# Altium schematic sheet Sheet1.SchDoc
size A4; SheetNumber: 1; SheetTotal: 1
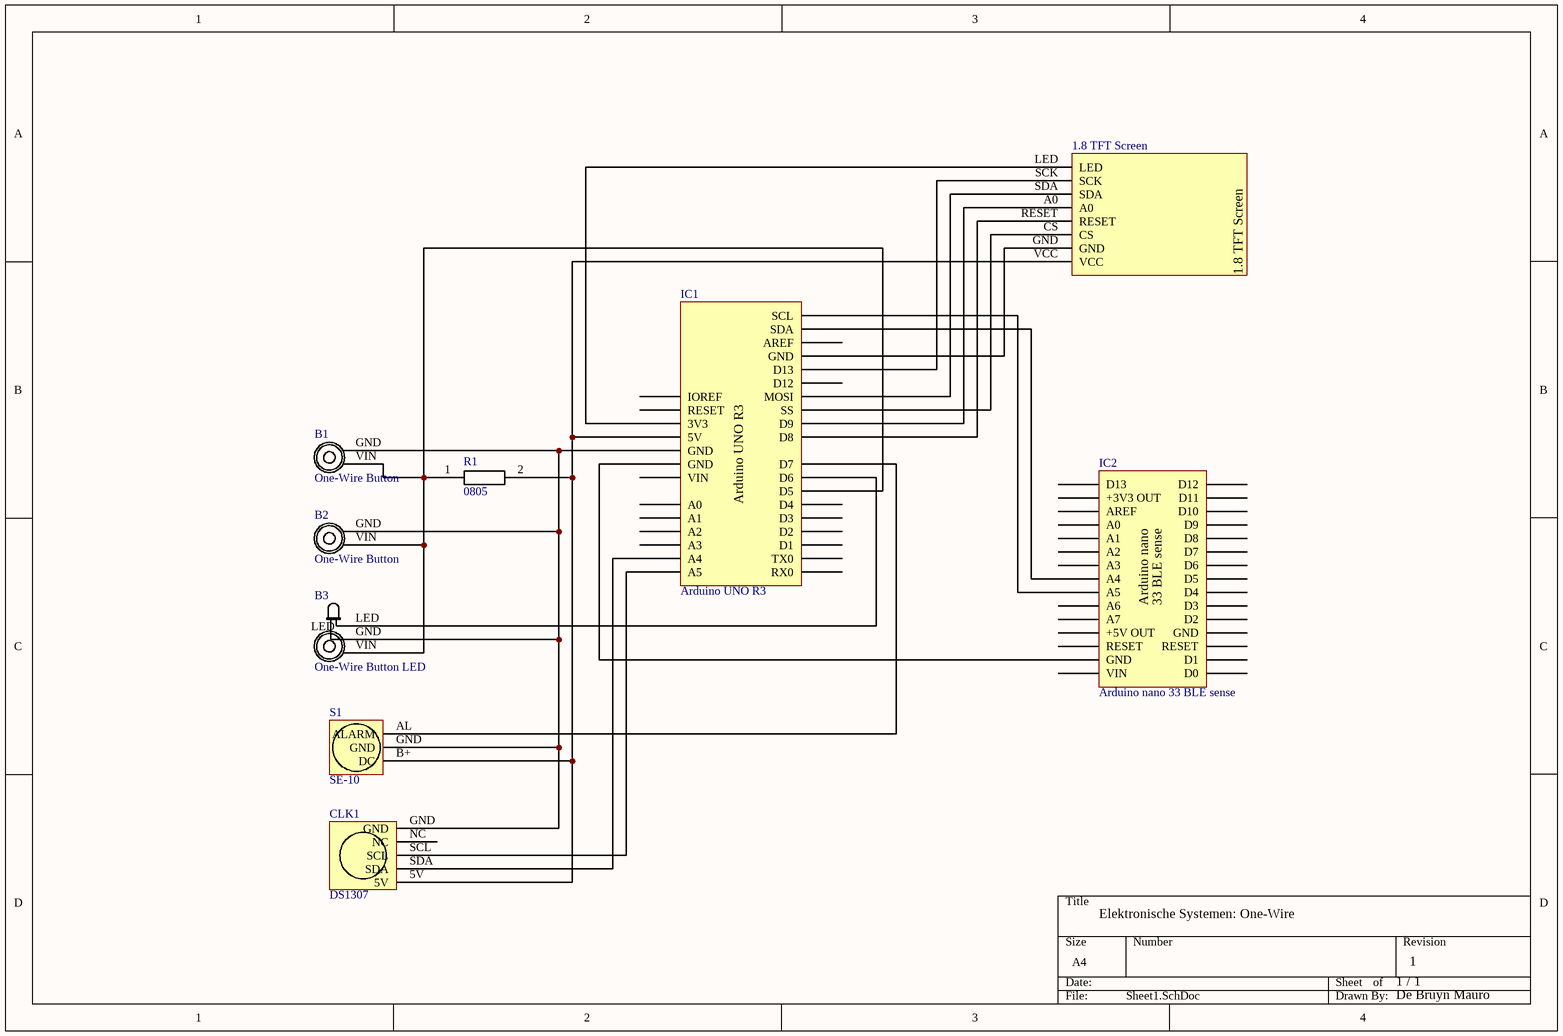
[diagram p0: Sheet1.SchDoc]

## Parts
1.8_TFT_Screen  (no value)
B1  One-Wire Button
B2  One-Wire Button
B3  One-Wire Button LED
CLK1  DS1307
IC1  Arduino UNO R3
IC2  Arduino nano 33 BLE sense
R1  0805
S1  SE-10

## Nets
Net1.8_TFT_Screen_A0: 1.8_TFT_Screen.A0 IC1.D9
Net1.8_TFT_Screen_CS: 1.8_TFT_Screen.CS IC1.D10(SS)
Net1.8_TFT_Screen_GND: 1.8_TFT_Screen.GND IC1.GROUND(GND)
Net1.8_TFT_Screen_LED: 1.8_TFT_Screen.LED IC1.3V3
Net1.8_TFT_Screen_RESET: 1.8_TFT_Screen.RESET IC1.D8
Net1.8_TFT_Screen_SCK: 1.8_TFT_Screen.SCK IC1.SCK(D13)
Net1.8_TFT_Screen_SDA: 1.8_TFT_Screen.SDA IC1.D11(MOSI)
Net1.8_TFT_Screen_VCC: 1.8_TFT_Screen.VCC CLK1.5V IC1.5V(VIN) R1.2 S1.B+(DC)
NetB1_GND: B1.GND B2.GND B3.GND CLK1.GND IC1.GND S1.GND
NetB1_VIN: B1.VIN B2.VIN B3.VIN IC1.D5 R1.1
NetB3_LED: B3.LED IC1.D6
NetCLK1_SCL: CLK1.SCL IC1.A5
NetCLK1_SDA: CLK1.SDA IC1.A4
NetIC1_D7: IC1.D7 S1.AL(ALARM)
NetIC1_GND: IC1.GND IC2.GND
NetIC1_SCL: IC1.SCL IC2.A5
NetIC1_SDA: IC1.SDA IC2.A4

Not connected (* = marked no-connect by the designer): CLK1 NC; IC1 A0 A1 A2 A3 AREF D0(RX0) D1(TX0) D2 D3 D4 IOREF MISO(D12) RESET; IC2 +3V3 OUT +5V OUT A0 A1 A2 A3 A6 A7 AREF D0 D1 D2 D3 D4 D5 D6 D7 D8 D9 D10 D11 D12 D13 RESET VIN

## Notes on the sheet
- Elektronische Systemen: One-Wire
- 1 / 1
- 1
- De Bruyn Mauro
- (in symbol Arduino nano 33 BLE sense) Arduino nano; 33 BLE sense

## Library data of the parts
1.8_TFT_Screen = 1.8 TFT Screen